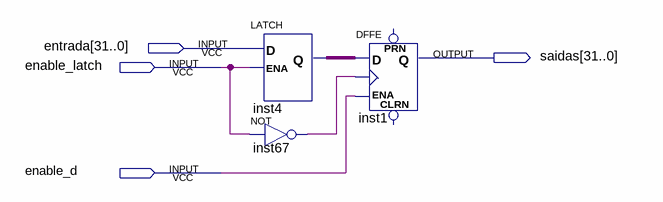
[diagram p0: schematic sheet]
// Quartus schematic Barramento_32xIFID.bdf as structural Verilog: 3 symbols, 4 pins
module Barramento_32xIFID (
  input  [31:0] entrada,
  input  enable_latch,
  input  enable_d,
  output [31:0] saidas
);

  wire inst4_q, inst67_out;

  LATCH inst4[31:0] (.D(entrada), .ENA(enable_latch), .Q(inst4_q));
  not inst67 (inst67_out, enable_latch);
  DFFE inst1[31:0] (.D(inst4_q), .CLK(inst67_out), .ENA(enable_d), .Q(saidas));  // open: PRN, CLRN
endmodule
